# Altium schematic sheet Microcontrolled Buck Converter (1).SchDoc
size Letter; SheetNumber: 1; SheetTotal: 1
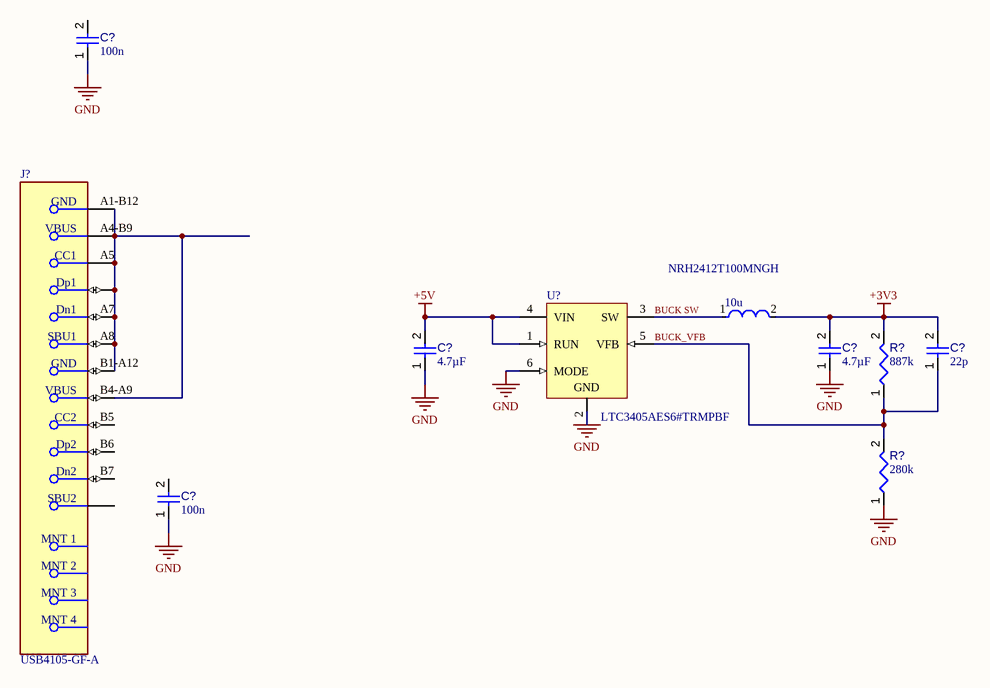
[diagram p0: Microcontrolled Buck Converter (1).SchDoc]

## Parts
(Parts that share a designator on the sheet are numbered #1, #2 ... from top to bottom, then left to right.)
10u  NRH2412T100MNGH  [FP-NRH2412-MFG]
C?#1  value 100n  [CAPC0805(2012)145_L]  (hidden comment: Capacitor 4.7µF +/-40% 25V 0805)
C?#2  value 4.7µF  [CAPC0805(2012)145_L]  (hidden comment: Capacitor 4.7µF +/-40% 25V 0805)
C?#3  value 4.7µF  [CAPC0805(2012)145_L]  (hidden comment: Capacitor 4.7µF +/-40% 25V 0805)
C?#4  value 22p  [CAPC0603(1608)100_L]  (hidden comment: Capacitor 470nF +/-20% 25V 0603)
C?#5  value 100n  [CAPC0805(2012)145_L]  (hidden comment: Capacitor 4.7µF +/-40% 25V 0805)
J?  USB4105-GF-A  [FP-USB4105-GF-A-MFG]
R?#1  value 887k  [RESC0603(1608)_L]  (hidden comment: Resistor 120R +/-5 % 0603 0.1 W)
R?#2  value 280k  [RESC0603(1608)_L]  (hidden comment: Resistor 120R +/-5 % 0603 0.1 W)
U?  LTC3405AES6#TRMPBF  [LT-S6-6-TSOT-23_M]

## Nets
+3V3: 10u.2 C?#3.2 C?#4.2 R?#1.2
+5V: C?#2.2 U?.1(RUN) U?.4(VIN)
GND: C?#1.1 C?#2.1 C?#3.1 C?#5.1 R?#2.1 U?.2(GND) U?.6(MODE)
BUCK SW: 10u.1 U?.3(SW)
BUCK_VFB: C?#4.1 R?#1.1 R?#2.2 U?.5(VFB)
NetJ?_A1-B12: J?.A1-B12(GND) J?.A4-B9(VBUS) J?.A5(CC1) J?.A6(Dp1) J?.A7(Dn1) J?.A8(SBU1) J?.B1-A12(GND) J?.B4-A9(VBUS)

Not connected (* = marked no-connect by the designer): C?#1 2; C?#5 2; J? B5(CC2) B6(Dp2) B7(Dn2) B8(SBU2)

## Notes on the sheet
- (in symbol CMP-245163-000001-1) MNT 1; MNT 2; MNT 3; MNT 4

## Library data of the parts
10u = CMP-14484-000582-1: Shielded Wirewound Inductor 10uH 20% 0.51A 0.72Ω SMD; DC Resistance (DCR): 600mR; Current Rating: 450mA; Saturation Current: 810mA; Core Material: Ferrite; Test Frequency: 100kHz; Self Resonant Frequency: 29MHz; Termination: SMD/SMT; Shielding: Shielded; Height - Seated (Max): 0.047inch; Case/Package: Nonstandard; Tolerance: 20%; Height: 1.2mm; Package Quantity: 2500; Mount: Surface Mount; Min Operating Temperature: -25°C; Inductance: 10uH; Width: 0.095inch; Length: 0.095inch; RoHS Compliant: Yes; Max DC Current: 810mA; Packaging: Tape and Reel; Max Operating Temperature: 120°C; Halogen Free: Halogen Free
C?#1-C?#3 C?#5 = CMP-001-00080-4: Chip Capacitor, 4.7µF +/-40%, 25V, 0805, Thickness 1.45 mm; Tolerance: 20%; Voltage Rating: 25V; Min Operating Temperature: -55°C; Max Operating Temperature: 85°C; Pins: 2; Mounting Technology: SMT; Case/Package: 0805
C?#4 = CMP-001-00077-3: Chip Capacitor, 470nF +/-20%, 25V, 0603, Thickness 1 mm; Tolerance: 10%; Max Operating Temperature: 85°C; Voltage Rating: 25V; Pins: 2; Case/Package: 0603; Mounting Technology: SMT; Min Operating Temperature: -55°C
J? = CMP-245163-000001-1: CONN RCPT USB2.0 TYPEC 5A; Manufacturer: GCT; Voltage Rating: 20V; Is Female: yes; Current Rating: 5/6.25/1.25/0.25A; Number Of Contacts: 16; Conn Orientation: Right Angle; Device Class L1: Connectors; Category: Conn; Lead Free: Yes; RoHS: TRUE; Temperature Range High: +85°C; Digikey Description: CONN RCPT USB2.0 TYPEC 5A; Device Class L3: unset; ComponentLink2Description: Datasheet; Manufacturer Part Number: USB4105-GF-A; Package: 0; Usb Standard: USB 2.0; Device Class L2: USB Connectors; Automotive: No; Temperature Range Low: -40°C; Height: 3.46mm; Temperature: -40°C to +85°C; Contact Material: Gold,Nickel; ComponentLink2URL: https://gct.co/files/drawings/usb4105.pdf; Octopart: https://octopart.com/usb4105-gf-a-gct-106627878
R?#1 R?#2 = CMP-009-00176-3: Chip Resistor, 120 Ohms, +/-5 %, 0.1 W, -55 to 155 degC, 0603; Power: 100mW; Tolerance: 5%; Max Operating Temperature: 155°C; Pins: 2; Case/Package: 0603; Min Operating Temperature: -55°C
U? = CMP-031-00007-1: Switching Regulator, Current-mode, 0.63A, 1800kHz Switching Freq-Max, PDSO6; Max Supply Voltage: 5.5V; Min Operating Temperature: 0°C; RoHS Compliant: Yes; Pins: 6; Max Operating Temperature: 70°C; Case/Package: VSSOP